# EasyEDA Pro project 校内赛最小系统板(第二版).eprj

# Schematic Schematic1

## Sheets
1 12V->5V: Board Name: Board1; Create Date: 2025-10-25; Page Name: 12V->5V; Project Name: 校内赛最小系统板; Schematic Name: Schematic1; Update Date: 2025-11-01; Company: 嘉立创EDA; Page Size: A4; Version: V1.0
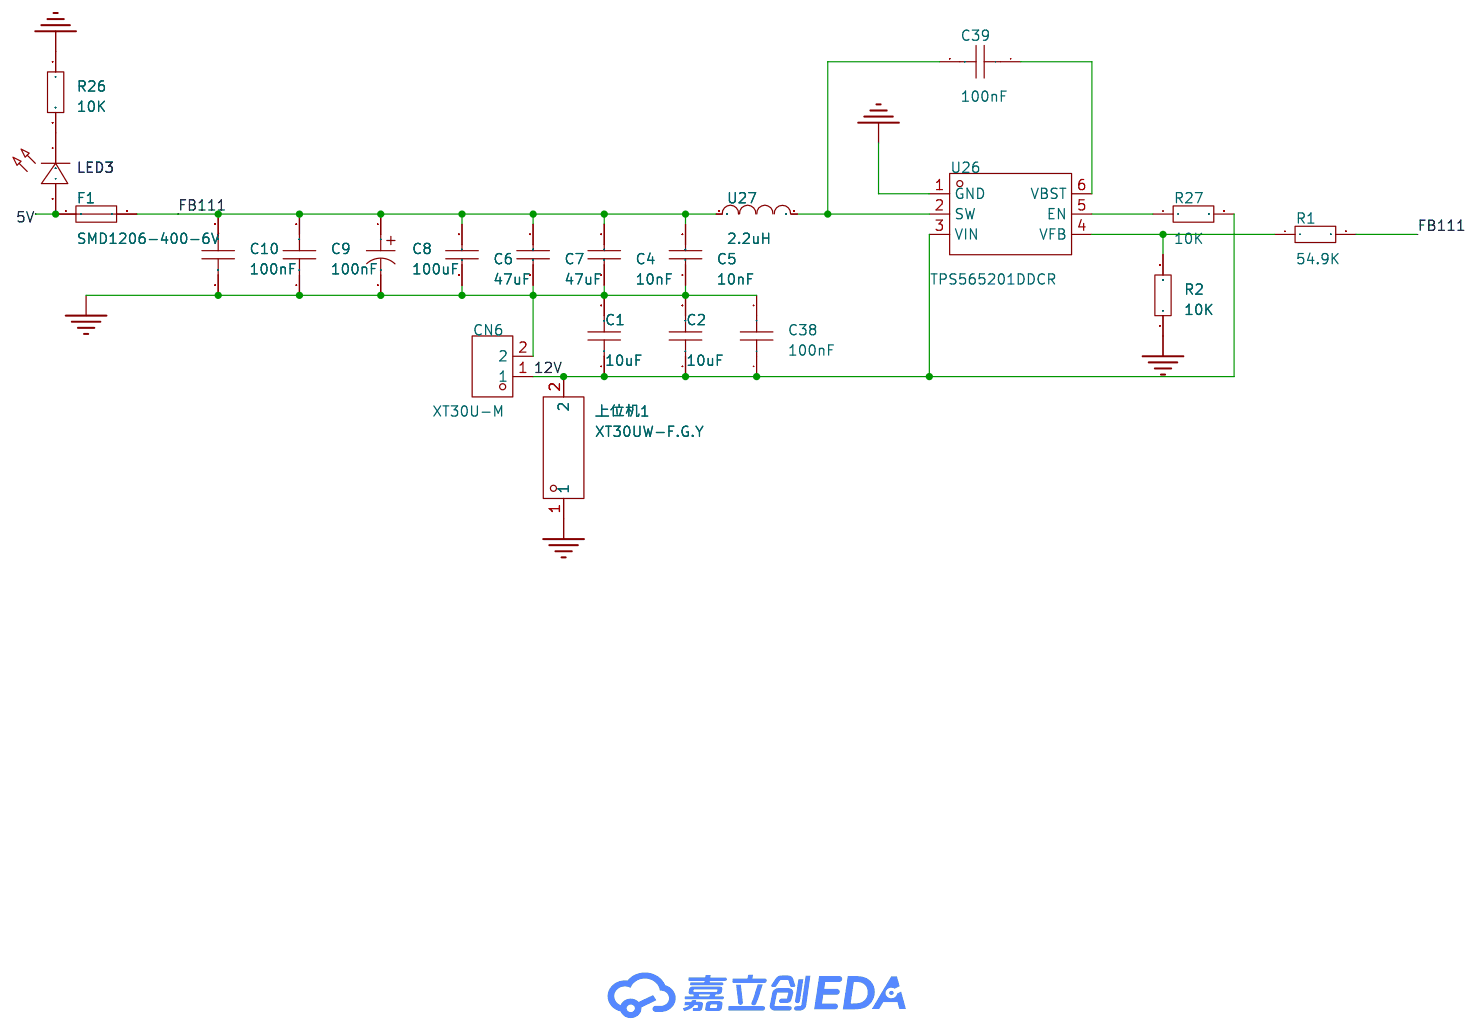
[diagram p0: 12V->5V]
2 最小系统: Page Name: 最小系统; Update Date: 2025-10-28
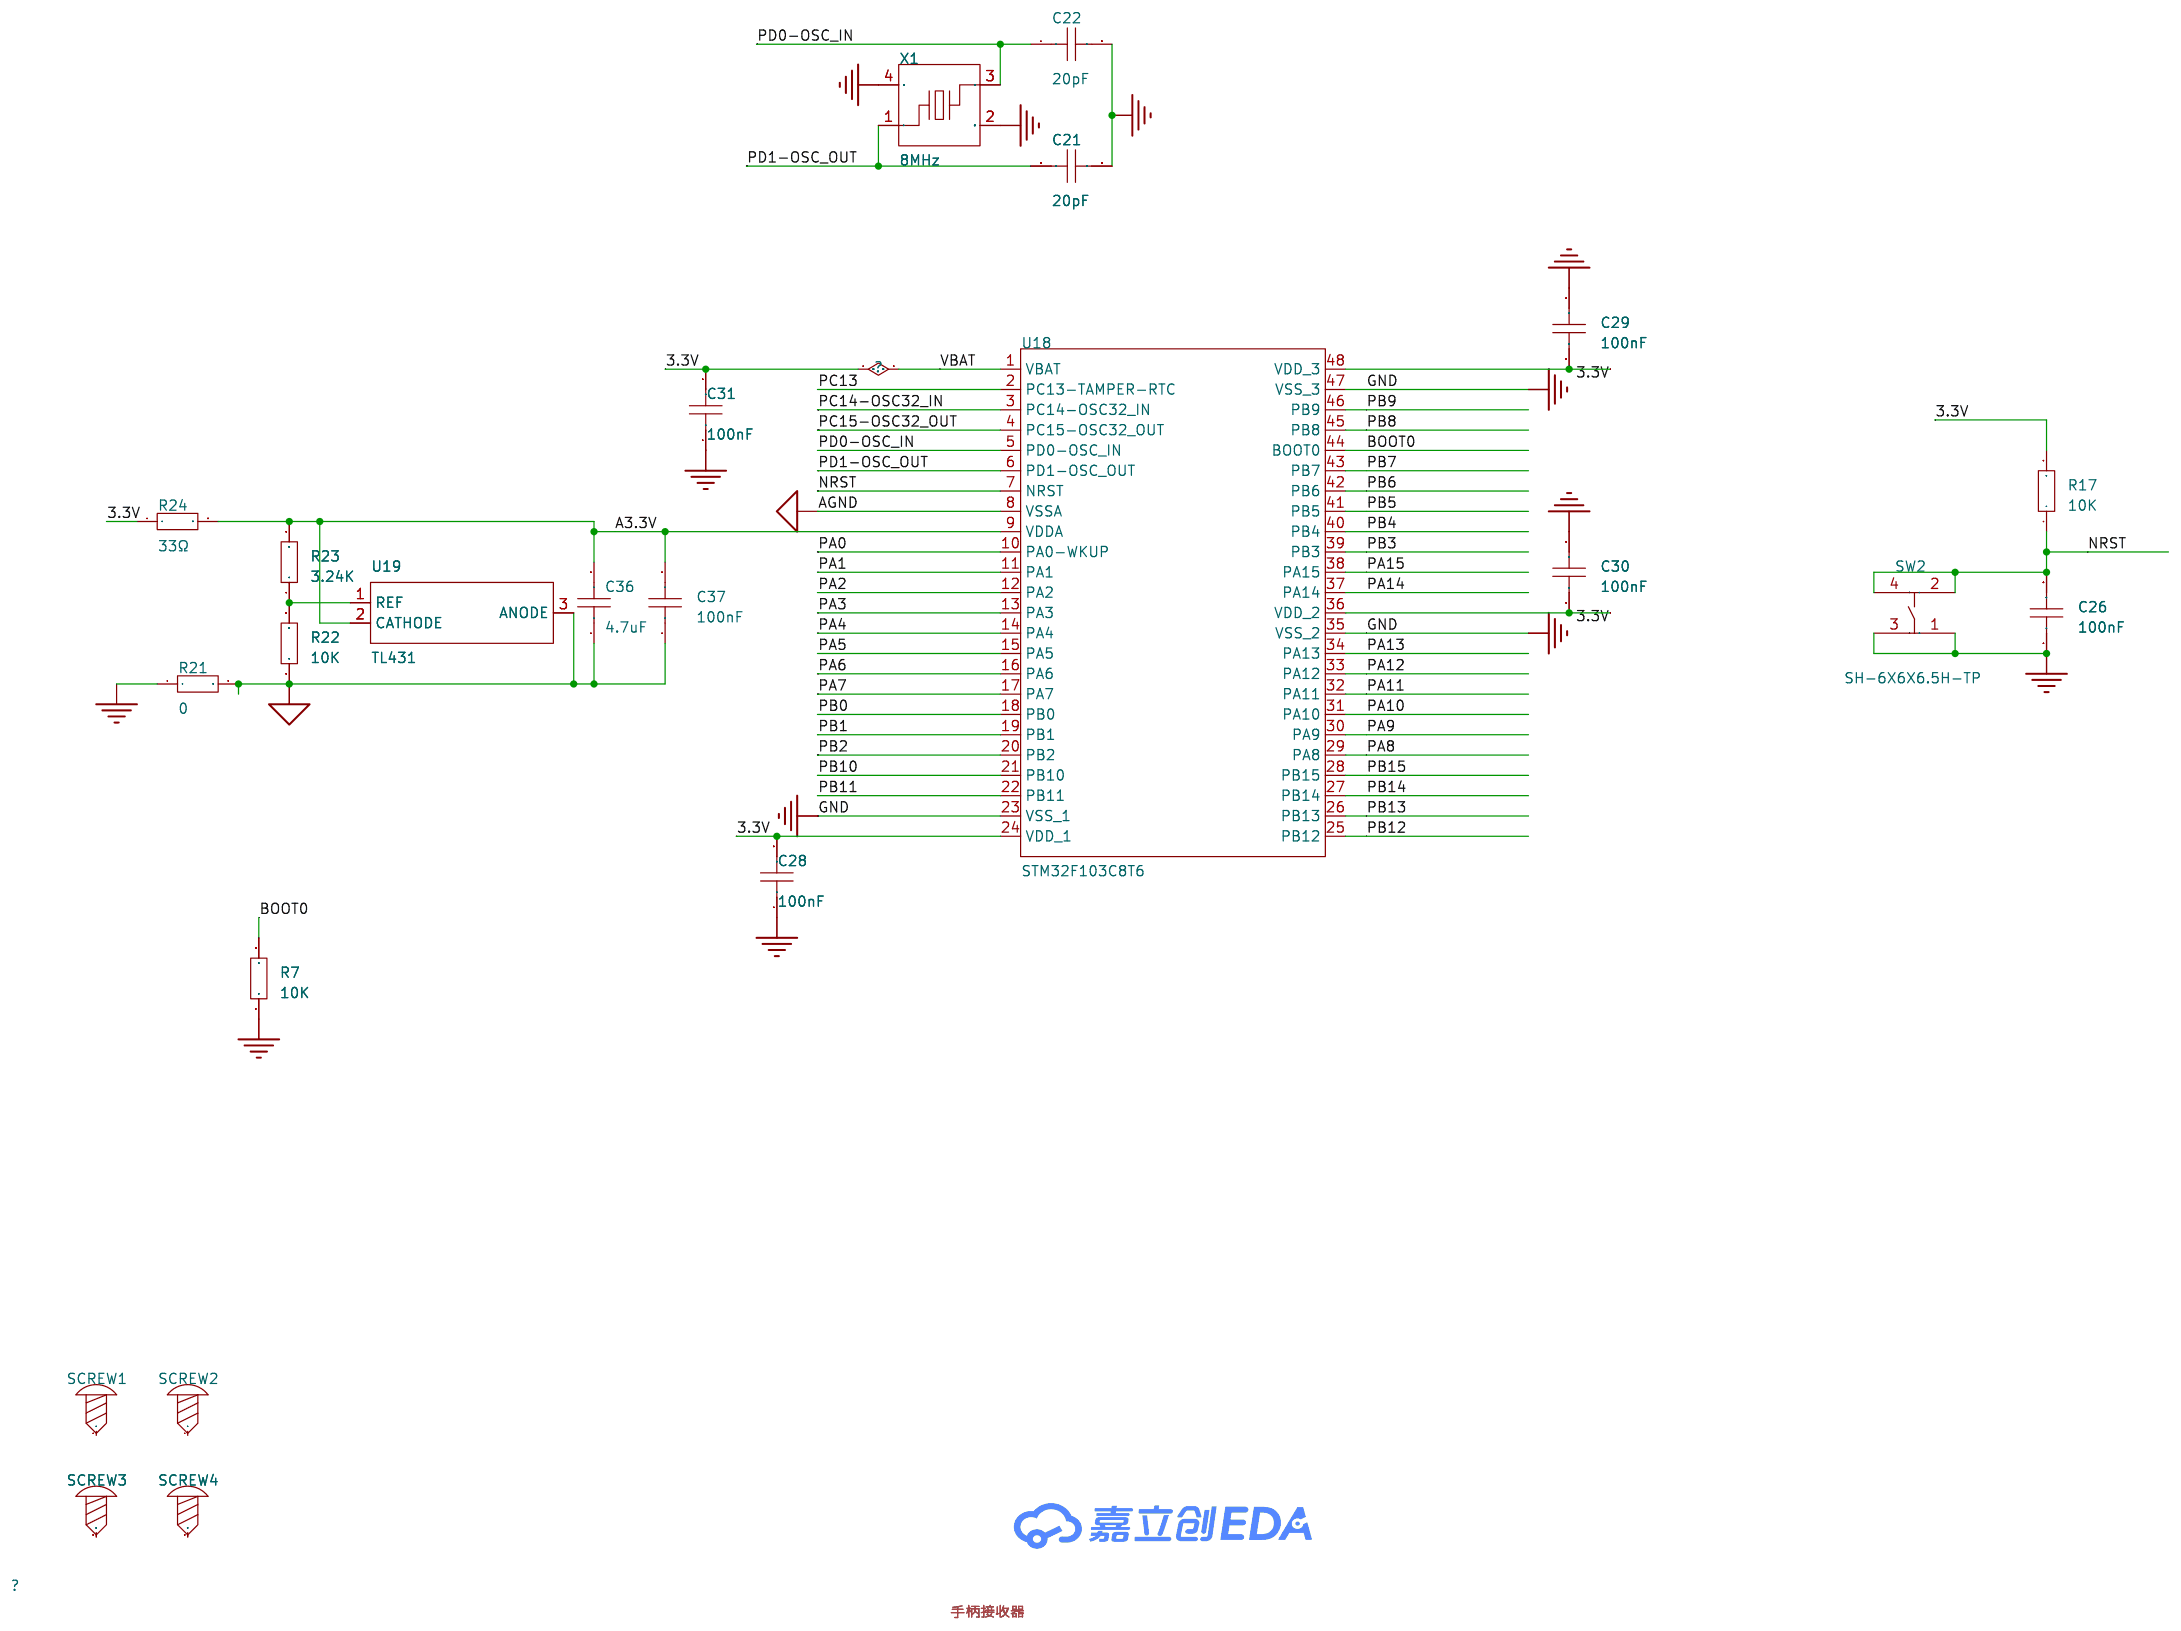
[diagram p1: 最小系统]
3 接口: Create Date: 2025-10-27; Page Name: 接口; Update Date: 2025-10-29
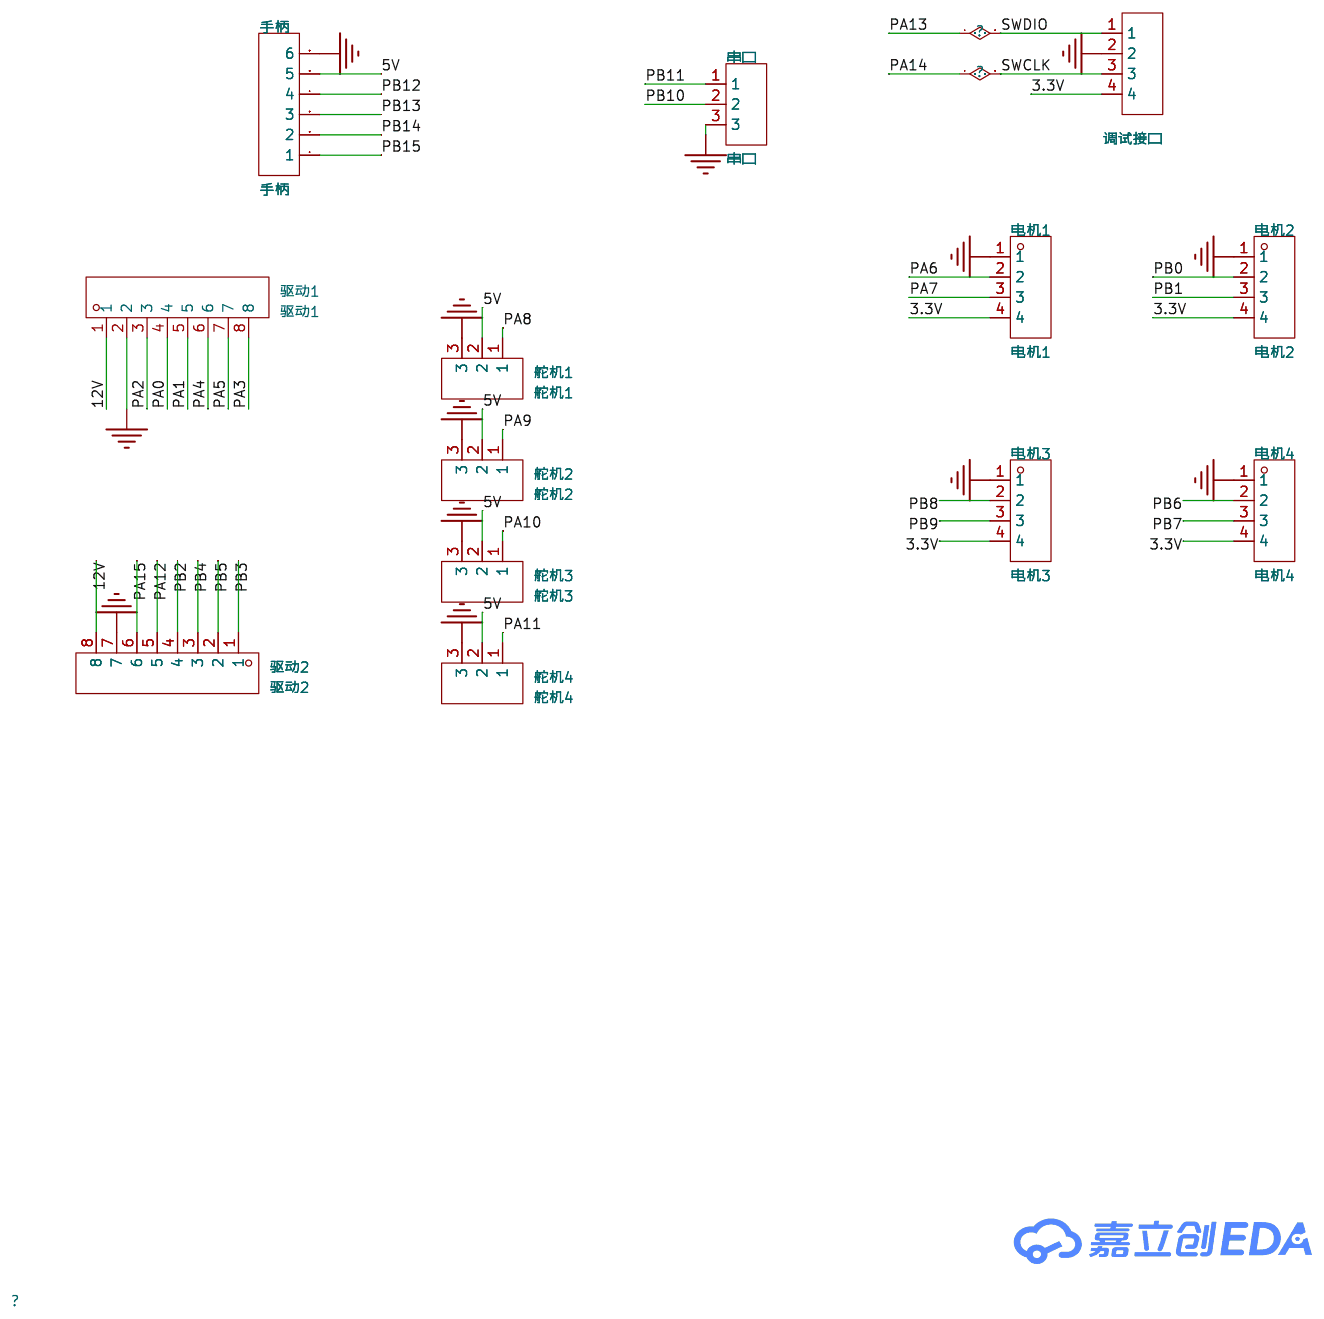
[diagram p2: 接口]
4 5V->3.3V: Create Date: 2025-10-27; Page Name: 5V->3.3V; Update Date: 2025-10-27
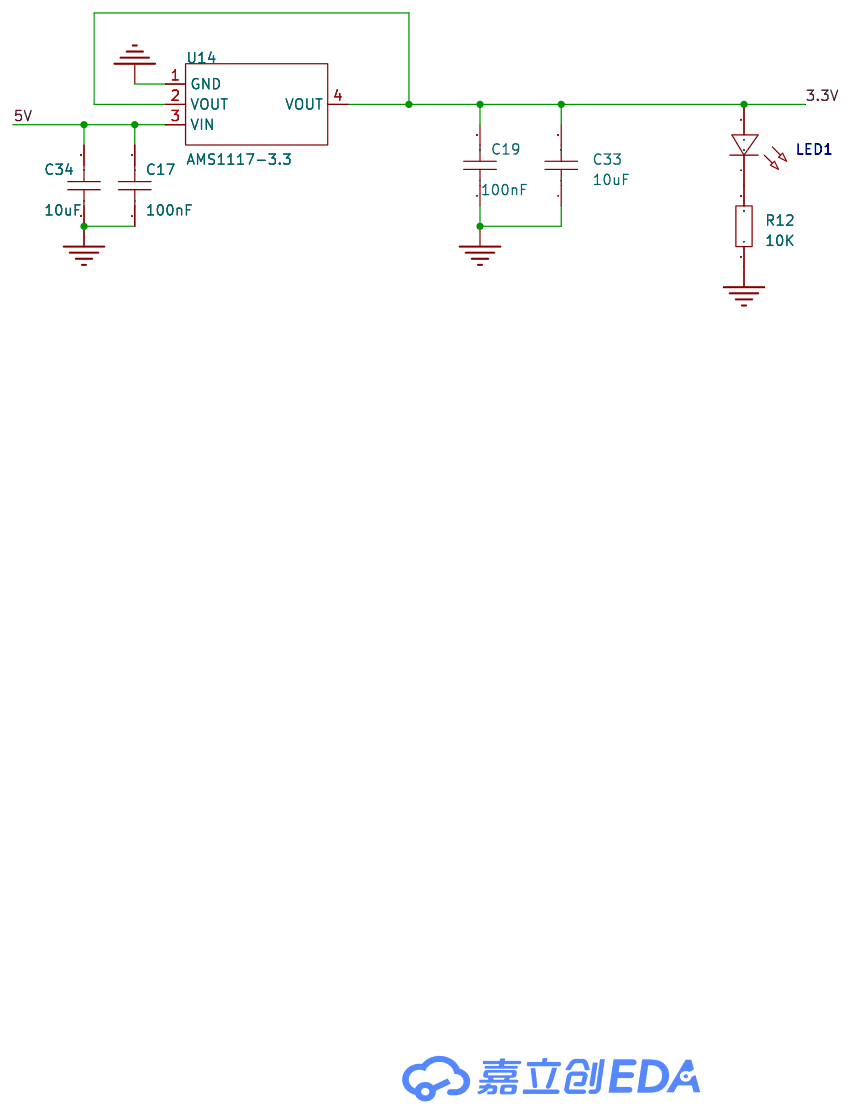
[diagram p3: 5V->3.3V]

## Parts
sheet 5V->3.3V
C17  100nF  [C0603]
C19  100nF  [C0603]
C33  10uF  [C1206]
C34  10uF  [C1206]
LED1  -  [LED_0603]
R12  10K  [R0603]
U14  AMS1117-3.3  [SOT-223-3_L6.5-W3.4-P2.30-LS7.0-BR]
sheet 12V->5V
C1  10uF  [C1206]
C2  10uF  [C1206]
C4  10nF  [C0603]
C5  10nF  [C0603]
C6  47uF  [C1210]
C7  47uF  [C1210]
C8  100uF  [CAP-SMD_BD6.3-L6.6-W6.6-LS7.2-FD_3]
C9  100nF  [C0603]
C10  100nF  [C0603]
C38  100nF  [C0603]
C39  100nF  [C0603]
CN6  XT30U-M  [CONN-TH_XT30U-M]
F1  SMD1206-400-6V  [F1206]
LED3  -  [LED_0603]
R1  54.9K  [R0603]
R2  10K  [R0603]
R26  10K  [R0603]
R27  10K  [R0603]
U26  TPS565201DDCR  [SOT-23-6_L2.9-W1.6-P0.95-LS2.8-BR]
U27  2.2uH  [IND-SMD_L7.0-W6.6]
上位机1  XT30UW-F.G.Y  [CONN-TH_XT30UW-F.G.Y]
sheet 接口
串口  串口  [HDR-TH_3P-P2.54-V-M]
手柄  手柄  [HDR-TH_6P-P2.54-V-M-1]
电机1  电机1  [HDR-TH_4P-P2.54-V-M]
电机2  电机2  [HDR-TH_4P-P2.54-V-M]
电机3  电机3  [HDR-TH_4P-P2.54-V-M]
电机4  电机4  [HDR-TH_4P-P2.54-V-M]
舵机1  舵机1  [HDR-TH_3P-P2.54-V-M]
舵机2  舵机2  [HDR-TH_3P-P2.54-V-M]
舵机3  舵机3  [HDR-TH_3P-P2.54-V-M]
舵机4  舵机4  [HDR-TH_3P-P2.54-V-M]
调试接口  -  [HDR-TH_4P-P2.54-V-M]
驱动1  驱动1  [HDR-TH_8P-P2.54-V-M-4]
驱动2  驱动2  [HDR-TH_8P-P2.54-V-M-4]
sheet 最小系统
C21  20pF  [C0603]
C22  20pF  [C0603]
C26  100nF  [C0603]
C28  100nF  [C0603]
C29  100nF  [C0603]
C30  100nF  [C0603]
C31  100nF  [C0603]
C36  4.7uF  [C0603]
C37  100nF  [C0603]
R7  10K  [R1206]
R17  10K  [R1206]
R21  0  [R0603]
R22  10K  [R1206]
R23  3.24K  [R1206]
R24  33Ω  [R1206]
SCREW1  -  [M2螺丝]
SCREW2  -  [M2螺丝]
SCREW3  -  [M2螺丝]
SCREW4  -  [M2螺丝]
SW2  SH-6X6X6.5H-TP  [SW-SMD_4P-L6.0-W6.0-P4.50-LS8.8]
U18  STM32F103C8T6  [LQFP-48_L7.0-W7.0-P0.50-LS9.0-BL]
U19  TL431  [SOT-23-3_L2.9-W1.3-P1.90-LS2.4-BR]
X1  8MHz  [CRYSTAL-SMD_4P-L3.2-W2.5-BL_SIT8008BI]

## Library data of the parts
C17 C19 C21 C22 C26 C28-C31 C36 C37 = CAP_0603: Supplier Footprint: 0603
C1 C2 C33 C34 = CAP_1206: Supplier Footprint: 1206
LED1 LED3 = LED_0603-G: Supplier Footprint: 0603
R1 R2 R12 R21 R26 R27 = Res_0603: Supplier Footprint: 0603
U14 = AMS1117-3.3_C6186: 输出类型:固定;工作电压:16V;输出电压:3.3V;输出电流:1A;电源纹波抑制比(PSRR):72dB@(120Hz);输出极性:正极;; LCSC Part Name: 输出3.3V 1A; Supplier Part: C6186; Manufacturer: AMS; Supplier Footprint: SOT-223; JLCPCB Part Class: 基础库; Datasheet: https://item.szlcsc.com/datasheet/AMS1117-3.3/6652.html; Supplier: LCSC; Output Type: 固定; Voltage - Supply: 16V; Output Voltage: 3.3V; Output Current: 1A; Power Supply Rejection Ratio (PSRR): 72dB@(120Hz); Voltage Dropout: 1.1V@(800mA); standby current: 5mA; Features: 过流保护；过热保护; Operating Temperature: -40℃~+125℃; Output Configuration: 正极; Number of Outputs: 1
C4 C5 = 0603B103K500NT: LCSC Part Name: 10nF ±10% 50V; Supplier Part: C57112; Manufacturer: FH(风华); Supplier Footprint: 0603; JLCPCB Part Class: 基础库; Datasheet: https://item.szlcsc.com/datasheet/0603B103K500NT/58143.html; Supplier: LCSC; Tolerance: ±10%; Voltage Rating: 50V; Temperature Coefficient: X7R
C6 C7 = GRM32ER71A476KE15L: LCSC Part Name: 47uF ±10% 10V; Supplier Part: C84494; Manufacturer: muRata(村田); Supplier Footprint: 1210; JLCPCB Part Class: 扩展库; Datasheet: https://atta.szlcsc.com/upload/public/pdf/source/20161226/1482720144456.pdf; Supplier: LCSC; Tolerance: ±10%; Voltage Rated: 10V; Temperature Coefficient: X7R
C8 = JVJ16V100M6x5: LCSC Part Name: 100uF ±20% 16V; Supplier Part: C46550396; Manufacturer: JIERR(捷而瑞); Supplier Footprint: SMD,D6.3xL5.4mm; JLCPCB Part Class: 扩展库; Datasheet: https://item.szlcsc.com/datasheet/JVJ16V100M6x5/48680090.html; Supplier: LCSC; Tolerance: ±20%; Voltage Rating: 16V; Ripple Current: 60mA@120Hz; Diameter: 6.3mm; Height - Seated (Max): 5.4mm; Lifetime: 2000hrs@105℃; Operating Temperature: -55℃~+105℃
C9 C10 C38 C39 = CC0603KRX7R9BB104: LCSC Part Name: 100nF ±10% 50V; Supplier Part: C14663; Manufacturer: YAGEO(国巨); Supplier Footprint: 0603; JLCPCB Part Class: 基础库; Datasheet: https://item.szlcsc.com/datasheet/CC0603KRX7R9BB104/15331.html; Supplier: LCSC; Tolerance: ±10%; Voltage Rating: 50V; Temperature Coefficient: X7R
CN6 = XT30U-M: LCSC Part Name: AMASS(艾迈斯)轻量版锂电池插头公头 XT30U-M; Supplier Part: C99101; Manufacturer: AMASS(艾迈斯); JLCPCB Part Class: 扩展库; Datasheet: https://item.szlcsc.com/datasheet/XT30U-M/100314.html; Supplier: LCSC; Type: 插头; Colour: 黄色; InterfaceType: 公头
F1 = SMD1206-400-6V: LCSC Part Name: 6V 4A 1206自恢复; Supplier Part: C2760306; Manufacturer: BNstar(比诺星); Supplier Footprint: 1206; JLCPCB Part Class: 扩展库; Datasheet: https://item.szlcsc.com/datasheet/SMD1206-400-6V/2880918.html; Supplier: LCSC; Voltage - Max: 6V; Current - Max: 50A; Hold Current: 4A; Trip Current: 8A; Power Dissipation: 1.5W; Resistance - Initial (Ri) (Min): 1mΩ; Resistance - Post Trip (R1) (Max): 18mΩ; Time to Trip(Max): 5s; Operating Temperature: -40℃~+70℃; Length: 3.5mm; Width: 1.85mm; Height: 1mm
U26 = TPS565201DDCR: LCSC Part Name: 4.5V至17V输入、5A同步降压稳压器; Supplier Part: C327676; Manufacturer: TI(德州仪器); Supplier Footprint: TSOT-23-6; JLCPCB Part Class: 扩展库; Datasheet: https://www.ti.com.cn/cn/lit/ds/symlink/tps565201.pdf; Supplier: LCSC; Function: 降压型; Output Type: 可调; Input Voltage: 4.5V~17V; Output Voltage: 760mV~7V; Output Current: 5A; Switching Frequency: 500kHz; Operating Temperature: -40℃~+125℃; Synchronous Rectification: 是; Number of Outputs: 1; Topology: 降压式; Switch tube (built-in/external): 内置
U27 = FAUL0650-2R2MT: LCSC Part Name: 2.2uH ±20% 11A; Supplier Part: C3040365; Manufacturer: cjiang(长江微电); Supplier Footprint: SMD,7x6.6mm; JLCPCB Part Class: 扩展库; Datasheet: https://item.szlcsc.com/datasheet/FAUL0650-2R2MT/3597542.html; Supplier: LCSC; Tolerance: ±20%; Current Rating: 9A; Current - Saturation(Isat): 11A; DC Resistance(DCR): 12.5mΩ; Ratings: AEC-Q200
上位机1 = XT30UW-F.G.Y: LCSC Part Name: XT30UW防水锁扣镀金15A二芯母插头; Supplier Part: C19268025; Manufacturer: AMASS(艾迈斯); JLCPCB Part Class: 扩展库; Datasheet: https://item.szlcsc.com/datasheet/XT30UW-F.G.Y/20526036.html; Supplier: LCSC
串口 舵机1-舵机4 = PZ254V-11-03P: LCSC Part Name: 1x3P 间距:2.54mm 方针 直插; Supplier Part: C2937625; Manufacturer: XFCN(兴飞); Supplier Footprint: 插件,P=2.54mm; JLCPCB Part Class: 扩展库; Datasheet: https://item.szlcsc.com/datasheet/PZ254V-11-03P/3293280.html; Supplier: LCSC; Pin Structure: 1x3P; Pitch: 2.54mm; Circluar Pins/Square Pins: 方针; Mounting Type: 直插; Number of Rows: 单排; Number of Pins: 3P; Current Rating: 3A; Voltage Rating (Max): 250V; Length of Mating Pin: 6mm; Insulation Height: 2.5mm; Length of End Connection Pin: 3mm; Operating Temperature: -40℃~+105℃; Color: 黑色
手柄 = 2.54-1x6P直针: LCSC Part Name: 1x6P 间距:2.54mm 方针 直插; Supplier Part: C37208; Manufacturer: BOOMELE(博穆精密); Supplier Footprint: 插件,P=2.54mm; JLCPCB Part Class: 扩展库; Datasheet: https://item.szlcsc.com/datasheet/2.54-1x6P%25E7%259B%25B4%25E9%2592%2588/38187.html; Supplier: LCSC; Pin Structure: 1x6P; Pitch: 2.54mm; Circluar Pins/Square Pins: 方针; Mounting Type: 直插; Number of Rows: 单排; Number of Pins: 6P; Current Rating: 3A; Length of Mating Pin: 6mm; Insulation Height: 2.5mm; Length of End Connection Pin: 3mm; Contact Material: 黄铜; Contact Plating: 金; Operating Temperature: -40℃~+105℃; Color: 黑色
电机1-电机4 = PZ254V-11-04P: LCSC Part Name: 1x4P 间距:2.54mm 方针 直插; Supplier Part: C2691448; Manufacturer: XFCN(兴飞); Supplier Footprint: 插件,P=2.54mm; JLCPCB Part Class: 扩展库; Datasheet: https://item.szlcsc.com/datasheet/PZ254V-11-04P/2801085.html; Supplier: LCSC; Pin Structure: 1x4P; Pitch: 2.54mm; Circluar Pins/Square Pins: 方针; Mounting Type: 直插; Number of Rows: 单排; Number of Pins: 4P; Current Rating: 3A; Voltage Rating (Max): 250V; Length of Mating Pin: 6mm; Insulation Height: 2.5mm; Length of End Connection Pin: 3mm; Operating Temperature: -40℃~+105℃; Color: 黑色
调试接口 = HDR-M_2.54_1x4P: Supplier Part: C492403; Supplier Footprint: 插件; JLCPCB Part Class: 扩展库
驱动1 驱动2 = 2.54mmx8: Supplier Part: C9900030426; Supplier Footprint: 2.54*8P/30mm; JLCPCB Part Class: 扩展库; Supplier: LCSC
R7 R17 R22-R24 = Res_1206: Supplier Footprint: 1206
SCREW1-SCREW4 = M2螺丝: Supplier Footprint: 插件
SW2 = SH-6X6X6.5H-TP: 电路结构:单刀单掷;按钮形状:圆形按钮;作用力:2.5N;安装方式:立贴;开关长度:6mm;开关宽度:6mm;开关高度:6.5mm;带支架:不带支架;触点电流:50mA;额定电压:12V;带灯:无;工作寿命:10万次;; LCSC Part Name: 6*6/6x6 轻触开关; Supplier Part: C42416255; Manufacturer: SHOU HAN(首韩); Supplier Footprint: SMD-4P,6x6mm; JLCPCB Part Class: 扩展库; Datasheet: https://item.szlcsc.com/datasheet/SH-6X6X6.5H-TP/44415302.html; Supplier: LCSC; Circuit: 单刀单掷; Actuator Style: 圆形按钮; Operating Force: 2.5N; Mounting Type: 立贴; Length: 6mm; Width: 6mm; Switch Height: 6.5mm; with Bracket: 不带支架; Contact Current: 50mA; Voltage Rating: 12V; Actuator/Cap Color: 黑色; With Lamp: 无; Termination Style: 鸥翼型; Life: 10万次; Operating Temperature: -25℃~+70℃
U18 = STM32F103C8T6: CPU内核:ARM-M3;CPU最大主频:72MHz;应用领域:-;; LCSC Part Name: 主流增强型ARM Cortex-M3 MCU，具有64 KB Flash、72 MHz CPU、电机控制、USB和CAN; Supplier Part: C8734; Manufacturer: ST(意法半导体); Supplier Footprint: LQFP-48(7x7); JLCPCB Part Class: 扩展库; Datasheet: https://item.szlcsc.com/datasheet/STM32F103C8T6/9243.html; Supplier: LCSC; CPU Core: ARM-M3; CPU Maximum Speed: 72MHz; Program Storage Size: 64KB; Program Memory Type: FLASH; Number of I/O: 37; ADC (Bit): 12bit; Voltage - Supply: 2V~3.6V
U19 = TL431: Supplier Part: C2887585; Manufacturer: YFSEMI(江苏佑风微); Supplier Footprint: SOT-23; JLCPCB Part Class: 扩展库; Datasheet: https://item.szlcsc.com/datasheet/TL431/3105114.html; Supplier: LCSC
X1 = XL2EL89CSI-111YLC-8M: 晶振类型:贴片晶振;频率:8MHz;常温频差:±10ppm;负载电容:20pF;频率稳定度:±20ppm;; LCSC Part Name: YSX321SL 8MHZ 4P 3225 20PF ±10PPM -40~85℃ (±20PPM); Supplier Part: C5444548; Manufacturer: YXC(扬兴晶振); Supplier Footprint: SMD3225-4P; JLCPCB Part Class: 扩展库; Datasheet: https://item.szlcsc.com/datasheet/XL2EL89CSI-111YLC-8M/6336544.html; Supplier: LCSC; Type: 贴片晶振; Normal temperature Frequency Tolerance: ±10ppm; Load Capacitance: 20pF; Frequency Stability: ±20ppm; Operating Temperature: -40℃~+85℃

## Nets
3.3V: C19.2 C28.2 C29.2 C30.2 C31.2 C33.2 LED1.2(A) R17.2 R24.1 U14.2(VOUT) U14.4(VOUT) U18.1(VBAT) U18.24(VDD_1) U18.36(VDD_2) U18.48(VDD_3) 电机1.4 电机2.4 电机3.4 电机4.4 调试接口.4
5V: C17.2 C34.2 F1.1 LED3.2(A) U14.3(VIN) 手柄.5 舵机1.2 舵机2.2 舵机3.2 舵机4.2
12V: C1.1 C2.1 C38.1 CN6.1 R27.2 U26.3(VIN) 上位机1.2 驱动1.1 驱动2.8
A3.3V: C36.2 C37.2 R23.2 R24.2 U18.9(VDDA) U19.2(CATHODE)
AGND: C36.1 C37.1 R21.2 R22.1 U18.8(VSSA) U19.3(ANODE)
GND: C1.2 C2.2 C4.1 C5.1 C6.1 C7.1 C8.2 C9.1 C10.1 C17.1 C19.1 C21.2 C22.2 C26.1 C28.1 C29.1 C30.1 C31.1 C33.1 C34.1 C38.2 CN6.2 R2.1 R7.1 R12.1 R21.1 R26.1 SW2.1 SW2.3 U14.1(GND) U18.23(VSS_1) U18.35(VSS_2) U18.47(VSS_3) U26.1(GND) X1.2(GND) X1.4(GND) 上位机1.1 串口.3 手柄.6 电机1.1 电机2.1 电机3.1 电机4.1 舵机1.3 舵机2.3 舵机3.3 舵机4.3 调试接口.2 驱动1.2 驱动2.7
BOOT0: R7.2 U18.44(BOOT0)
FB111: C4.2 C5.2 C6.2 C7.2 C8.1 C9.2 C10.2 F1.2 R1.2 U27.1
NRST: C26.2 R17.1 SW2.2 SW2.4 U18.7(NRST)
PA0: U18.10(PA0-WKUP) 驱动1.4
PA1: U18.11(PA1) 驱动1.5
PA2: U18.12(PA2) 驱动1.3
PA3: U18.13(PA3) 驱动1.8
PA4: U18.14(PA4) 驱动1.6
PA5: U18.15(PA5) 驱动1.7
PA6: U18.16(PA6) 电机1.2
PA7: U18.17(PA7) 电机1.3
PA8: U18.29(PA8) 舵机1.1
PA9: U18.30(PA9) 舵机2.1
PA10: U18.31(PA10) 舵机3.1
PA11: U18.32(PA11) 舵机4.1
PA12: U18.33(PA12) 驱动2.5
PA13: U18.34(PA13) 调试接口.1
PA14: U18.37(PA14) 调试接口.3
PA15: U18.38(PA15) 驱动2.6
PB0: U18.18(PB0) 电机2.2
PB1: U18.19(PB1) 电机2.3
PB2: U18.20(PB2) 驱动2.4
PB3: U18.39(PB3) 驱动2.1
PB4: U18.40(PB4) 驱动2.3
PB5: U18.41(PB5) 驱动2.2
PB6: U18.42(PB6) 电机4.2
PB7: U18.43(PB7) 电机4.3
PB8: U18.45(PB8) 电机3.2
PB9: U18.46(PB9) 电机3.3
PB10: U18.21(PB10) 串口.2
PB11: U18.22(PB11) 串口.1
PB12: U18.25(PB12) 手柄.4
PB13: U18.26(PB13) 手柄.3
PB14: U18.27(PB14) 手柄.2
PB15: U18.28(PB15) 手柄.1
PC13: U18.2(PC13-TAMPER-RTC)
PC14-OSC32_IN: U18.3(PC14-OSC32_IN)
PC15-OSC32_OUT: U18.4(PC15-OSC32_OUT)
PD0-OSC_IN: C22.1 U18.5(PD0-OSC_IN) X1.3
PD1-OSC_OUT: C21.1 U18.6(PD1-OSC_OUT) X1.1
$1N6828: C39.2 U26.2(SW) U27.2
$1N7531: LED3.1(C) R26.2
$1N7618: C39.1 U26.6(VBST)
$1N7672: R27.1 U26.5(EN)
$1N7875: R1.1 R2.2 U26.4(VFB)
$2N2524: R22.2 R23.1 U19.1(REF)
$4N488: LED1.1(C) R12.2

Not connected (* = marked no-connect by the designer): SCREW1 1; SCREW2 1; SCREW3 1; SCREW4 1

# Board PCB1
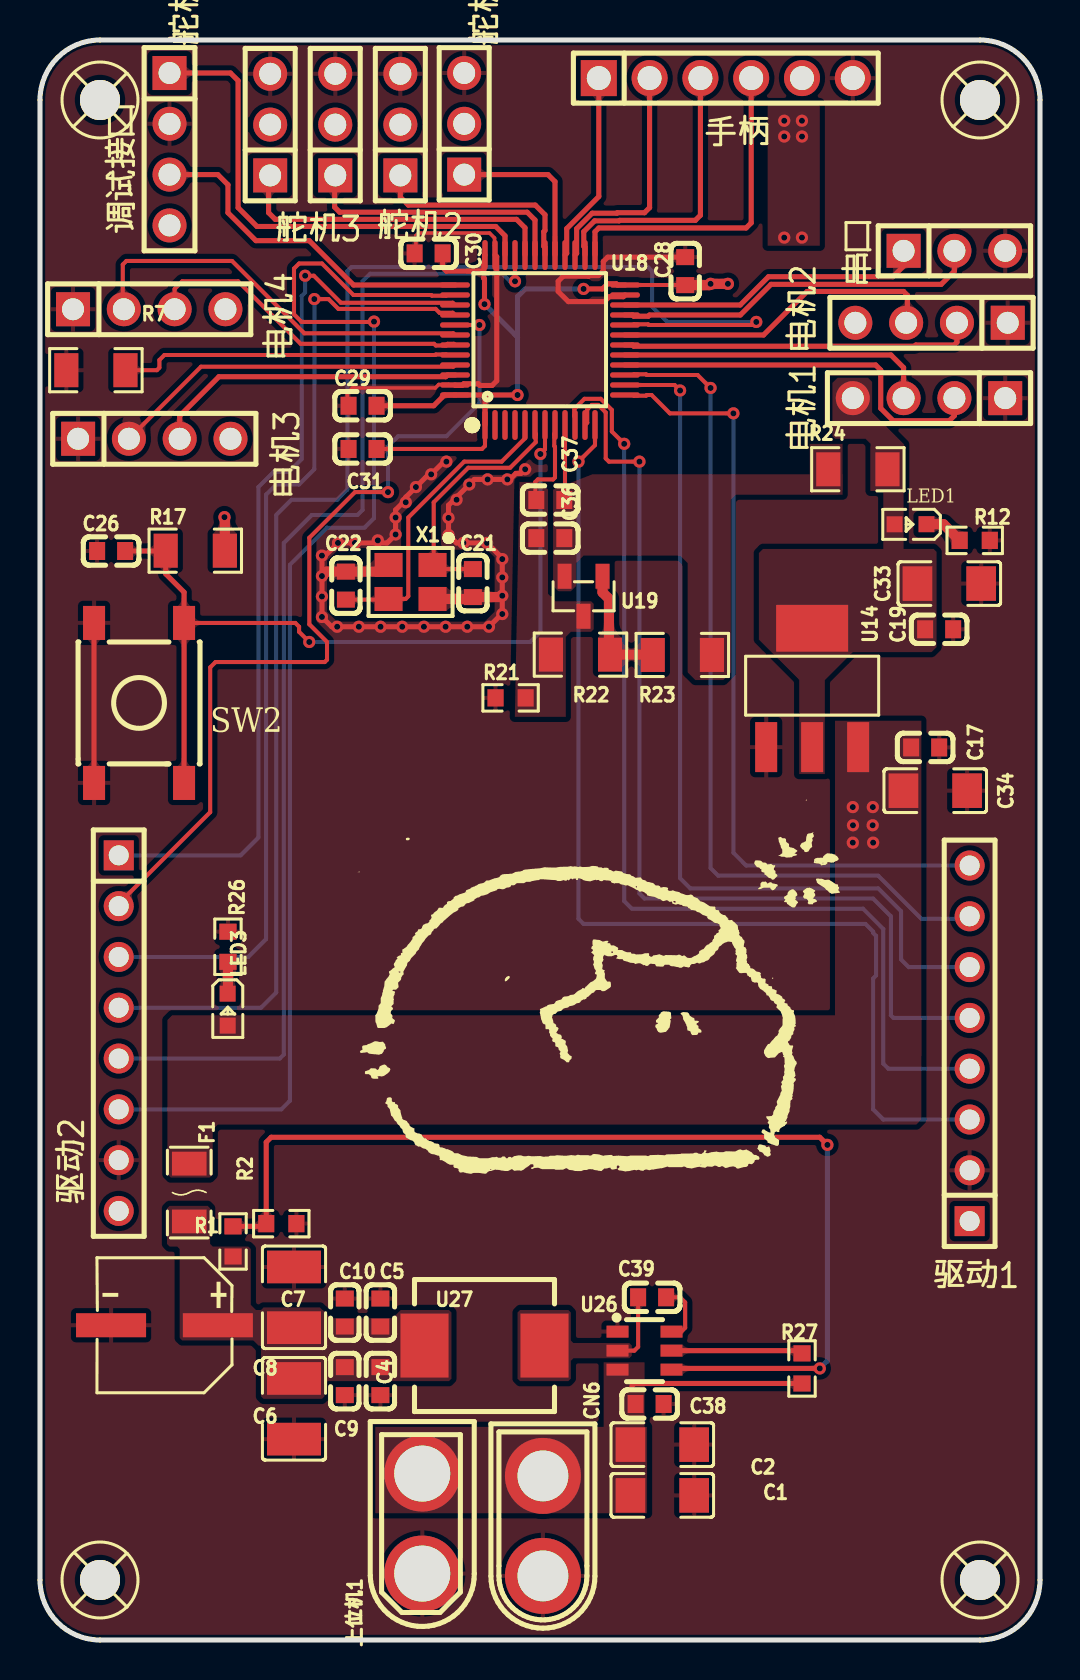
[diagram p4: board, top side]
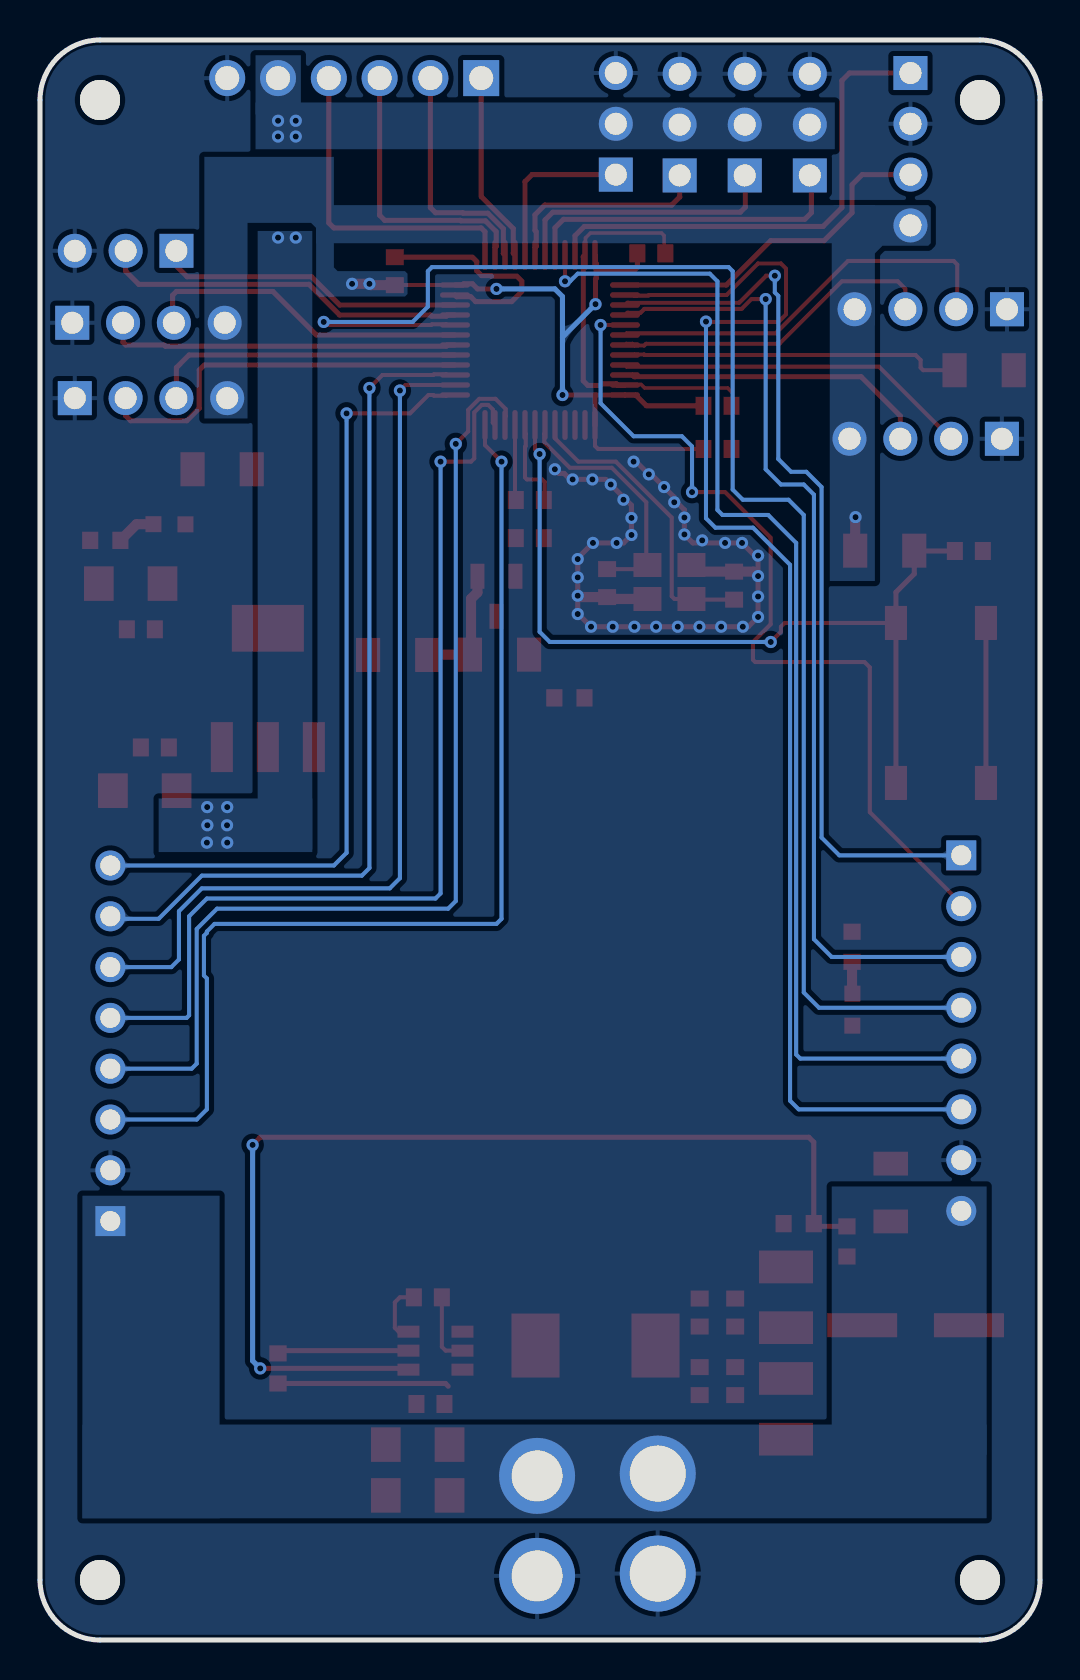
[diagram p5: board, bottom side, seen from below]

Outline 50 x 80 mm; copper layers: Top Layer, Bottom Layer. Coordinates in mm from the lower left corner of the outline.
Outline path: 0,77 0,3 arc(0.88,0.88) 3,0 47,0 arc(49.12,0.88) 50,3 50,77 arc(49.12,79.12) 47,80 3,80 arc(0.88,79.12) 0,77
Stack: Top Layer 0.035mm / Dielectric1 1.51mm FR4 er 4.5 / Bottom Layer 0.035mm

## Design rules (mm)
template: JLCPCB Capability(Two Layers Board)
spacing copperThickness1oz (default): track to track 0.102, other pairs 0.152 to 0.3
spacing copperThickness2oz: track to track 0.203, other pairs 0.152 to 0.3
track width copperThickness1oz (default): min 0.127, default 0.254, max 2.54
track width copperThickness2oz: min 0.203, default 0.254, max 2.54
differential pair differentialPair (default): width min 0.127, default 0.254, max 2.54; gap min 0.152, default 0.152
via viaSize (default): diameter min 0.5, default 0.61, max 10; hole min 0.3, default 0.305, max 6.3

## Placement (name value [footprint] x y rotation side)
C1  10uF  [C1206]  31.12 9.77 0 top
C2  10uF  [C1206]  31.12 7.23 0 top
C4  10nF  [C0603]  17.02 12.94 90 top
C5  10nF  [C0603]  17.02 16.37 270 top
C6  47uF  [C1210]  12.7 11.56 90 top
C7  47uF  [C1210]  12.7 17.13 270 top
C8  100uF  [CAP-SMD_BD6.3-L6.6-W6.6-LS7.2-FD_3]  6.22 15.74 180 top
C9  100nF  [C0603]  15.24 12.94 90 top
C10  100nF  [C0603]  15.24 16.37 270 top
C17  100nF  [C0603]  44.26 44.63 180 top
C19  100nF  [C0603]  44.96 50.54 180 top
C21  20pF  [C0603]  21.65 52.85 270 top
C22  20pF  [C0603]  15.3 52.72 90 top
C26  100nF  [C0603]  3.56 54.45 0 top
C28  100nF  [C0603]  32.26 68.44 270 top
C29  100nF  [C0603]  16.13 61.71 0 top
C30  100nF  [C0603]  19.43 69.33 0 top
C31  100nF  [C0603]  16.13 59.55 0 top
C33  10uF  [C1206]  45.47 52.82 180 top
C34  10uF  [C1206]  44.76 42.47 180 top
C36  4.7uF  [C0603]  25.51 55.09 0 top
C37  100nF  [C0603]  25.51 57 0 top
C38  100nF  [C0603]  30.48 11.8 0 top
C39  100nF  [C0603]  30.61 17.13 180 top
CN6  XT30U-M  [CONN-TH_XT30U-M]  25.15 5.71 270 top
F1  SMD1206-400-6V  [F1206]  7.46 22.37 270 top
LED1  -  [LED_0603]  43.48 55.78 180 top
LED3  -  [LED_0603]  9.39 31.47 270 top
R1  54.9K  [R0603]  9.65 19.93 270 top
R2  10K  [R0603]  12.06 20.82 180 top
R7  10K  [R1206]  2.79 63.49 0 top
R12  10K  [R0603]  46.74 54.98 180 top
R17  10K  [R1206]  7.76 54.47 0 top
R21  0  [R0603]  23.53 47.11 0 top
R22  10K  [R1206]  27.02 49.27 0 top
R23  3.24K  [R1206]  32.12 49.25 0 top
R24  33Ω  [R1206]  40.89 58.54 180 top
R26  10K  [R0603]  9.4 34.66 270 top
R27  10K  [R0603]  38.1 13.58 270 top
SCREW1  -  [M2螺丝]  47 77 0 top
SCREW2  -  [M2螺丝]  3 77 0 top
SCREW3  -  [M2螺丝]  47 3 0 top
SCREW4  -  [M2螺丝]  3 3 0 top
SW2  SH-6X6X6.5H-TP  [SW-SMD_4P-L6.0-W6.0-P4.50-LS8.8]  4.95 46.85 90 top
U14  AMS1117-3.3  [SOT-223-3_L6.5-W3.4-P2.30-LS7.0-BR]  38.61 47.61 270 top
U18  STM32F103C8T6  [LQFP-48_L7.0-W7.0-P0.50-LS9.0-BL]  25 65 0 top
U19  TL431  [SOT-23-3_L2.9-W1.3-P1.90-LS2.4-BR]  27.18 52.19 90 top
U26  TPS565201DDCR  [SOT-23-6_L2.9-W1.6-P0.95-LS2.8-BR]  30.23 14.47 180 top
U27  2.2uH  [IND-SMD_L7.0-W6.6]  22.22 14.72 0 top
X1  8MHz  [CRYSTAL-SMD_4P-L3.2-W2.5-BL_SIT8008BI]  18.53 52.9 180 top
上位机1  XT30UW-F.G.Y  [CONN-TH_XT30UW-F.G.Y]  19.11 5.82 90 top
串口  串口  [HDR-TH_3P-P2.54-V-M]  45.72 69.46 0 top
手柄  手柄  [HDR-TH_6P-P2.54-V-M-1]  34.29 78.09 0 top
电机1  电机1  [HDR-TH_4P-P2.54-V-M]  44.45 62.09 180 top
电机2  电机2  [HDR-TH_4P-P2.54-V-M]  44.58 65.86 180 top
电机3  电机3  [HDR-TH_4P-P2.54-V-M]  5.72 60.06 0 top
电机4  电机4  [HDR-TH_4P-P2.54-V-M]  5.46 66.54 0 top
舵机1  舵机1  [HDR-TH_3P-P2.54-V-M]  21.21 75.81 90 top
舵机2  舵机2  [HDR-TH_3P-P2.54-V-M]  18.02 75.77 90 top
舵机3  舵机3  [HDR-TH_3P-P2.54-V-M]  14.76 75.77 90 top
舵机4  舵机4  [HDR-TH_3P-P2.54-V-M]  11.51 75.77 90 top
调试接口  -  [HDR-TH_4P-P2.54-V-M]  6.48 74.54 270 top
驱动1  驱动1  [HDR-TH_8P-P2.54-V-M-4]  46.48 29.83 90 top
驱动2  驱动2  [HDR-TH_8P-P2.54-V-M-4]  3.94 30.34 270 top

## Footprints (pads in the part's own frame, mm; a bottom-side part is the same pattern mirrored in y, then rotated)
C0603
  rect 0.8x0.9 smd: 1(-0.7,0) 2(0.7,0)
C1206
  rect 1.485x1.728 smd: 1(-1.593,0) 2(1.593,0)
C1210
  rect 1.635x2.7 smd: 1(-1.518,0) 2(1.518,0)
CAP-SMD_BD6.3-L6.6-W6.6-LS7.2-FD_3
  rect 3.5x1.2 smd: 1(-2.67,0) 2(2.67,0)
CONN-TH_XT30U-M
  round 3.8 hole 2.54: 1(-2.5,0) 2(2.5,0)
CONN-TH_XT30UW-F.G.Y
  round 3.8 hole 2.8: 1(-2.5,0) 2(2.5,0)
CRYSTAL-SMD_4P-L3.2-W2.5-BL_SIT8008BI
  rect 1.4x1.2 smd: 1(-1.1,-0.85) 2(1.1,-0.85) 3(1.1,0.85) 4(-1.1,0.85)
F1206
  rect 1.19x1.728 smd: 1(-1.445,0) 2(1.445,0)
HDR-TH_3P-P2.54-V-M
  rect 1.7x1.7 hole 1.1: 1(-2.54,0)
  round 1.7 hole 1.1: 2(0,0) 3(2.54,0)
HDR-TH_4P-P2.54-V-M
  rect 1.7x1.7 hole 1.1: 1(-3.81,0)
  round 1.7 hole 1.1: 2(-1.27,0) 3(1.27,0) 4(3.81,0)
HDR-TH_6P-P2.54-V-M-1
  rect 1.8x1.8 hole 1.2: 1(-6.35,0)
  round 1.8 hole 1.2: 2(-3.81,0) 3(-1.27,0) 4(1.27,0) 5(3.81,0) 6(6.35,0)
HDR-TH_8P-P2.54-V-M-4
  rect 1.5x1.5 hole 1: 1(-8.89,0)
  round 1.5 hole 1: 2(-6.35,0) 3(-3.81,0) 4(-1.27,0) 5(1.27,0) 6(3.81,0) 7(6.35,0) 8(8.89,0)
IND-SMD_L7.0-W6.6
  rect 2.4x3.2 smd: 1(-3,0) 2(3,0)
LED_0603
  rect 0.8x0.8 smd: 1(-0.851,-0.01) 2(0.75,-0.005)
LQFP-48_L7.0-W7.0-P0.50-LS9.0-BL
  oval 0.27x1.5 smd: 1(-2.75,-4.25) 2(-2.25,-4.25) 3(-1.75,-4.25) 4(-1.25,-4.25) 5(-0.75,-4.25) 6(-0.25,-4.25) 7(0.25,-4.25) 8(0.75,-4.25) 9(1.25,-4.25) 10(1.75,-4.25) 11(2.25,-4.25) 12(2.75,-4.25) 25(2.75,4.25) 26(2.25,4.25) 27(1.75,4.25) 28(1.25,4.25) 29(0.75,4.25) 30(0.25,4.25) 31(-0.25,4.25) 32(-0.75,4.25) 33(-1.25,4.25) 34(-1.75,4.25) 35(-2.25,4.25) 36(-2.75,4.25)
  oval 1.5x0.27 smd: 13(4.25,-2.75) 14(4.25,-2.25) 15(4.25,-1.75) 16(4.25,-1.25) 17(4.25,-0.75) 18(4.25,-0.25) 19(4.25,0.25) 20(4.25,0.75) 21(4.25,1.25) 22(4.25,1.75) 23(4.25,2.25) 24(4.25,2.75) 37(-4.25,2.75) 38(-4.25,2.25) 39(-4.25,1.75) 40(-4.25,1.25) 41(-4.25,0.75) 42(-4.25,0.25) 43(-4.25,-0.25) 44(-4.25,-0.75) 45(-4.25,-1.25) 46(-4.25,-1.75) 47(-4.25,-2.25) 48(-4.25,-2.75)
M2螺丝
  round 2 hole 2: 1(0,0)
R0603
  rect 0.806x0.864 smd: 1(-0.753,0) 2(0.753,0)
R1206
  rect 1.208x1.701 smd: 1(-1.479,0) 2(1.479,0)
SOT-23-3_L2.9-W1.3-P1.90-LS2.4-BR
  rect 1.25x0.7 smd: 1(1,-0.95) 2(1,0.95) 3(-1,0)
SOT-23-6_L2.9-W1.6-P0.95-LS2.8-BR
  rect 1.1x0.6 smd: 1(1.35,-0.95) 2(1.35,0) 3(1.35,0.95) 4(-1.35,0.95) 5(-1.35,0) 6(-1.35,-0.95)
SOT-223-3_L6.5-W3.4-P2.30-LS7.0-BR
  rect 2.5x1.1 smd: 1(2.97,-2.3) 2(2.97,0) 3(2.97,2.3)
  rect 2.34x3.6 smd: 4(-2.97,0)
SW-SMD_4P-L6.0-W6.0-P4.50-LS8.8
  rect 1.7x1.1 smd: 1(-4,2.25) 2(-4,-2.25) 3(4,2.25) 4(4,-2.25)

## Nets
As in the schematic.

Pads without a net: SCREW1 1; SCREW2 1; SCREW3 1; SCREW4 1

## Via types
v1: diameter 0.61, hole 0.305, Top Layer to Bottom Layer, 69 vias

## Routing (per net, layer and track width the routed paths; a pad name or vN(x,y) marks a point on that pad's centre or on a via; arc(x,y) is an arc through that point)
3.3V: length 40.4
  Top Layer w0.203: U18.1 22.25,59.7 22.1,59.55 C31.2 ; U18.24 32.25,67.75 C28.2
  Top Layer w0.254: 22.19,68.4 22.19,68.81 22.22,68.85 22.22,69.22 U18.36 ; 22.19,68.4 22.15,68.44 20.32,68.44 20.13,68.63 C30.2 ; 22.19,68.4 22.19,68.08 22.22,68.05 v1(22.22,66.79) ; C29.2 19.69,61.71 20.22,62.25 U18.48 22.25,62.25 ; 22.25,62.25 v1(23.88,62.25) ; 22.25,62.25 U18.1 ; v1(27.18,67.55) 28.12,67.55 28.38,67.81 28.81,67.81 28.87,67.75 U18.24
  Top Layer w0.508: R17.2 9.24,56.12 v1(9.22,56.14) ; v1(34.4,67.81) v1(33.53,67.81) 33.46,67.74 C28.2
  Bottom Layer w0.254: v1(27.18,67.55) 24.26,67.55 23.88,67.17 23.88,65.14 ; v1(23.88,62.25) 23.88,65.14 ; 23.88,65.14 v1(22.22,66.79)
5V:
  vias: v1(37.21,75.96) v1(37.21,75.17) v1(37.21,70.12) v1(38.1,75.96) v1(38.1,75.17) v1(38.1,70.12) v1(40.64,41.65) v1(40.65,40.74) v1(40.64,39.87) v1(41.64,41.65) v1(41.63,40.74) v1(41.66,39.87)
12V: length 8.6
  Top Layer w0.254: R27.2 29.73,12.83 29.59,12.69
A3.3V: length 3.8
  Top Layer w0.203: C37.2 26.25,57.04 U18.9
AGND: length 4.7
  Top Layer w0.203: U18.8 25.75,60.34 25.71,60.3 25.71,59.7 25.75,59.66 25.75,58.12 25.65,58.03 24.89,58.03 24.76,57.9 24.76,57.05 24.81,57
GND: length 80.8
  Top Layer w0.178: U18.35 22.75,69.68 22.73,69.7 22.73,70.1 22.48,70.35 18.92,70.35 18.8,70.22 18.8,69.4 C30.1 ; C29.1 15.37,61.77 15.37,62.35 15.62,62.6 19.76,62.6 19.94,62.77 20.43,62.77 20.45,62.75 U18.47
  Top Layer w0.254: U18.23 29.16,67.16 28.46,67.16 28.22,66.92 26.42,66.92 25.91,67.43 25.91,67.94 26.16,68.19 27.43,68.19 27.46,68.22 27.92,68.22 28.16,68.46 28.16,68.92 28.39,69.14 C28.1 ; SW2.3 SW2.1 ; 24.41,58.54 v1(24.26,58.54) 24.05,58.33 23.8,58.33 23.5,58.03 v1(23.37,58.03) v1(22.38,58.03) 21.72,58.03 v1(21.46,57.78) 20.43,56.74 v1(20.43,56.1) v1(20.43,55.25) 20.82,54.85 v1(21.17,54.85) v1(22.35,54.85) 23.11,54.09 v1(23.11,54.05) v1(23.11,53.13) v1(23.11,52.21) 23.11,51.33 v1(22.45,50.66) v1(21.36,50.66) v1(20.28,50.66) v1(19.2,50.66) v1(18.11,50.66) v1(17.03,50.66) v1(15.94,50.66) 14.59,50.66 v1(14.1,51.15) v1(14.1,52.17) v1(14.1,53.2) 14.1,54.05 v1(14.9,54.85) v1(15.75,54.85) 17.36,54.85 v1(17.78,55.28) v1(17.78,56.12) 17.78,56.5 18.16,56.89 v1(18.29,56.89) 18.29,57.14 v1(18.8,57.65) 19.43,58.28 v1(19.56,58.28) 20.19,58.92 v1(20.32,58.92) ; U18.47 20.77,62.73 21.1,62.73 21.19,62.81 21.91,62.81 22,62.73 22.61,62.73 22.84,62.96 22.84,69.16 U18.35
  Top Layer w0.508: v1(14.1,53.2) 14.32,53.42 C22.2 17.09,53.42 X1.2 ; X1.4 21.55,52.05 C21.2 23.05,52.15 v1(23.11,52.21)
  vias: v1(14.1,54.22) v1(14.86,50.66) v1(16.89,54.98) v1(20.83,57.01) v1(23.11,51.3)
BOOT0: length 17
  Top Layer w0.203: U18.44 20.32,64.25 20.3,64.27 19.79,64.27 19.76,64.25 6.22,64.25 5.97,64 5.97,63.62 5.84,63.49 R7.2
NRST: length 43
  Top Layer w0.203: SW2.4 12.76,50.85 12.95,50.66 12.95,50.41 v1(13.46,49.9) ; U18.7 25.25,59.53 v1(25.02,59.3)
  Top Layer w0.254: C26.2 6.27,54.45 6.29,54.47 6.29,53.31 7.2,52.39 SW2.4 SW2.2
  Bottom Layer w0.203: v1(25.02,59.3) 25.02,50.41 24.51,49.9 v1(13.46,49.9)
PA0: length 52.6
  Top Layer w0.203: v1(29.21,59.81) 28.59,60.42 28.59,61.5 28.04,62.06 27.22,62.06 26.71,61.55 26.71,61.2 26.75,61.16 U18.10
  Bottom Layer w0.203: 驱动1.4 42.42,28.56 42.16,28.82 42.16,35.55 41.15,36.57 29.59,36.57 29.21,36.95 v1(29.21,59.81)
PA1: length 49.6
  Top Layer w0.203: U18.11 27.36,60.86 27.36,61.53 27.59,61.75 27.91,61.75 28.29,61.38 28.29,59.08 28.45,58.92 v1(29.97,58.92)
  Bottom Layer w0.203: v1(29.97,58.92) 29.97,37.33 30.23,37.07 41.66,37.07 42.54,36.19 42.54,31.23 42.67,31.11 驱动1.5
PA2: length 54.1
  Top Layer w0.203: U18.12 27.75,59.74 v1(26.92,58.92)
  Bottom Layer w0.203: v1(26.92,58.92) 26.92,36.06 27.18,35.8 41.28,35.8 41.66,35.42 41.66,35.36 41.8,35.21 41.8,33.22 41.66,33.08 41.66,26.53 42.16,26.03 驱动1.3
PA3: length 39.9
  Top Layer w0.203: U18.13 29.66,62.25 29.7,62.21 30.3,62.21 30.34,62.25 30.58,62.25 31.5,61.33 v1(34.67,61.33)
  Bottom Layer w0.203: 驱动1.8 35.31,38.72 34.67,39.36 v1(34.67,61.33)
PA4: length 45
  Top Layer w0.203: U18.14 31.73,62.75 v1(32,62.47)
  Bottom Layer w0.203: 驱动1.6 43.43,33.64 43.05,34.03 43.05,36.44 41.91,37.58 32.51,37.58 32,38.09 v1(32,62.47)
PA5: length 42.6
  Top Layer w0.203: v1(33.53,62.6) 32.88,63.25 30.34,63.25 30.3,63.29 29.7,63.29 29.66,63.25 U18.15
  Bottom Layer w0.203: 驱动1.7 46.35,36.06 44.07,36.06 41.91,38.22 33.91,38.22 33.53,38.6 v1(33.53,62.6)
PA6: length 19.7
  Top Layer w0.254: U18.16 41.78,63.75 42.04,63.5 42.04,61.58 42.66,60.96 45.47,60.96 45.72,61.22 电机1.2
PA7: length 15.7
  Top Layer w0.254: 电机1.3 43.18,63.62 42.55,64.25 U18.17
PA8: length 8.4
  Top Layer w0.254: 舵机1.1 25.4,73.27 25.75,72.92 U18.29
PA9: length 10.7
  Top Layer w0.254: 舵机2.1 18.02,72.14 18.41,71.75 24.76,71.75 25.25,71.26 25.25,70.48 25.19,70.42 25.19,69.69 25.25,69.63 U18.30
PA10: length 13.6
  Top Layer w0.254: U18.31 24.75,71 24.36,71.39 14.99,71.39 14.73,71.64 14.73,73.2 舵机3.1
PA11: length 16.4
  Top Layer w0.254: 舵机4.1 11.43,73.15 11.43,71.36 11.76,71.03 23.83,71.03 24.25,70.61 U18.32
PA12: length 59.2
  Top Layer w0.203: U18.33 v1(23.75,67.94)
  Bottom Layer w0.203: 3.94,29.07 11.99,29.07 12.19,29.28 12.19,54.85 13.59,56.25 15.88,56.25 16.13,56.5 16.13,67.94 16.51,68.32 23.11,68.32 23.5,67.94 v1(23.75,67.94)
PA13: length 24.8
  Top Layer w0.254: 调试接口.1 9.53,78.35 9.91,77.97 9.91,71.62 10.85,70.68 22.78,70.68 23.25,70.21 U18.34
PA14: length 17.4
  Top Layer w0.254: 调试接口.3 8.89,73.27 9.4,72.76 9.4,71.36 10.79,69.97 13.46,69.97 15.68,67.75 U18.37
PA15: length 65.8
  Top Layer w0.203: U18.38 20.34,67.25 20.3,67.21 19.6,67.21 19.56,67.25 15.67,67.25 14.1,68.82 12.95,68.82 12.7,68.57 12.7,66.28 13.08,65.9 16.68,65.9 v1(16.7,65.92)
  Bottom Layer w0.203: 驱动2.6 12.06,26.53 12.5,26.97 12.5,53.76 14.35,55.62 16.23,55.62 16.7,56.09 v1(16.7,65.92)
PB0: length 17.7
  Top Layer w0.254: 电机2.2 45.85,64.89 45.71,64.75 43.79,64.75 43.73,64.69 29.69,64.69 29.63,64.75 U18.18
PB1: length 16.5
  Top Layer w0.254: 电机2.3 43.37,65.92 43.37,67.24 43.18,67.43 38.35,67.43 36.18,65.25 U18.19
PB2: length 76.4
  Top Layer w0.203: v1(35.81,65.9) 35.66,65.75 30.44,65.75 30.4,65.79 29.7,65.79 29.66,65.75 U18.20
  Bottom Layer w0.203: v1(35.81,65.9) 31.37,65.9 30.61,66.67 30.61,68.44 30.4,68.64 15.57,68.64 15.37,68.44 15.37,57.52 14.86,57.01 12.57,57.01 11.81,56.25 11.81,32.38 11.05,31.61 驱动2.4
PB3: length 45
  Top Layer w0.203: U18.39 20.64,66.86 15.04,66.86 13.69,68.21 v1(13.26,68.21)
  Bottom Layer w0.203: v1(13.26,68.21) 13.26,67.38 13.09,67.21 13.09,59.05 12.45,58.41 11.68,58.41 10.92,57.65 10.92,40.12 10.03,39.23 驱动2.1
PB4: length 48.8
  Top Layer w0.203: v1(13.72,67.05) 14.43,67.05 14.92,66.56 19.78,66.56 19.97,66.36 20.64,66.36 U18.40
  Bottom Layer w0.203: v1(13.72,67.05) 13.72,58.54 12.95,57.78 11.81,57.78 11.3,57.27 11.3,35.04 10.41,34.15 驱动2.3
PB5: length 44.1
  Top Layer w0.203: 驱动2.2 3.94,36.82 8.51,41.39 8.51,48.63 8.78,48.9 14.24,48.9 14.35,49.01 14.35,49.9 13.47,50.79 13.47,55.11 15.75,57.39 v1(17.4,57.39) ; U18.41 v1(21.97,65.75)
  Bottom Layer w0.203: v1(21.97,65.75) 21.97,61.84 20.32,60.19 17.91,60.19 17.4,59.68 v1(17.4,57.39)
PB6: length 20.5
  Top Layer w0.203: 电机4.2 4.14,66.59 4.14,68.77 4.32,68.95 9.6,68.95 13.22,65.34 20.66,65.34 U18.42
PB7: length 16.6
  Top Layer w0.203: U18.43 20.69,64.81 20.38,64.81 20.3,64.73 19.79,64.73 19.71,64.81 13.03,64.81 9.91,67.94 7.11,67.94 6.73,67.55 电机4.3
PB8: length 17.8
  Top Layer w0.203: 4.44,60.06 8.05,63.66 20.66,63.66 U18.45
PB9: length 15.8
  Top Layer w0.254: 电机3.3 6.98,61.2 8.94,63.16 20.29,63.16 20.37,63.25 U18.46
PB10: length 18.4
  Top Layer w0.254: 串口.2 45.72,68.44 45.06,67.78 36.55,67.78 35.02,66.25 30.48,66.25 30.41,66.19 29.69,66.19 29.63,66.25 U18.21
PB11: length 15.5
  Top Layer w0.254: 串口.1 43.18,68.7 42.65,68.16 36.42,68.16 35.01,66.75 U18.22
PB12: length 16.4
  Top Layer w0.254: U18.25 27.75,70.41 27.94,70.6 35.31,70.6 35.56,70.86 手柄.4
PB13: length 14.2
  Top Layer w0.254: U18.26 27.25,69.63 27.19,69.69 27.19,70.42 27.73,70.96 28.96,70.96 28.98,70.98 32.77,70.98 33.02,71.24 手柄.3
PB14: length 11.9
  Top Layer w0.254: 手柄.2 30.48,71.62 30.23,71.36 28.86,71.36 28.84,71.34 27.61,71.34 26.83,70.56 26.83,69.33 U18.27
PB15: length 9.5
  Top Layer w0.254: 手柄.1 27.94,72.17 26.34,70.57 26.34,69.34 U18.28
PD0-OSC_IN: length 15.3
  Top Layer w0.203: 15.3,52.02 17.4,52.02 X1.3 18.28,52.05 18.41,52.19 18.41,56.12 21.21,58.92 23.08,58.92 24.25,60.09 U18.5
PD1-OSC_OUT: length 12.5
  Top Layer w0.203: C21.1 19.83,53.55 X1.1 19.69,53.81 19.69,56.89 21.41,58.61 23.51,58.61 24.79,59.89 24.79,60.3 24.75,60.34 U18.6
$1N6828: length 3.6
  Top Layer w0.203: U26.2 29.72,14.47 29.91,14.66 C39.2
$1N7531: length 1.6
  Top Layer w0.508: LED3.1 9.4,32.34 R26.2
$1N7618: length 3.1
  Top Layer w0.203: C39.1 32,17.13 32.26,16.88 32.26,15.61 32.06,15.42 U26.6
$1N7672: length 6.6
  Top Layer w0.254: U26.5 37.96,14.47 R27.1
$1N7875: length 52.9
  Top Layer w0.254: v1(38.99,13.58) 31.64,13.58 U26.4 ; R1.1 11.18,20.68 R2.2 11.31,24.89 11.56,25.14 38.99,25.14 v1(39.37,24.75)
  Bottom Layer w0.254: v1(38.99,13.58) 39.37,13.96 v1(39.37,24.75)
$2N2524: length 6.2
  Top Layer w0.508: R23.1 30.62,49.27 R22.2 28.45,49.32 28.45,52.06 28.13,52.38 U19.1
$4N488: length 2
  Top Layer w0.508: R12.2 45.17,55.79 LED1.1

## Copper pours and planes (outline as drawn; the poured copper is in the pictures)
3.3V on Top Layer: 35.94,54.55 44.83,54.55 44.83,43.3 35.94,43.3
3.3V on Top Layer: 41.53,59.68 43.21,59.68 43.21,57.46 41.53,57.46
3.3V on Top Layer: 39.62,63.11 43.21,63.11 43.21,57.46 39.62,57.46
3.3V on Top Layer: 42.16,59.68 43.18,59.68 43.18,54.35 42.16,54.35
3.3V on Bottom Layer: 8.25,67.55 10.51,67.55 10.51,52.95 8.25,52.95
3.3V on Bottom Layer: 8.25,71.75 36.19,71.75 36.19,69.84 8.25,69.84
3.3V on Bottom Layer: 39.62,74.16 41.78,74.16 41.78,61.08 39.62,61.08
3.3V on Bottom Layer: 31.62,74.16 40,74.16 40,67.17 31.62,67.17
3.3V on Bottom Layer: 5.46,71.75 10.41,71.75 10.41,65.65 5.46,65.65
5V on Top Layer: 36.38,76.84 38.99,76.84 38.99,69.71 36.38,69.71
5V on Top Layer: 39.75,45.96 44.07,45.96 44.07,29.2 39.75,29.2
5V on Top Layer: 6.37,31.23 44.07,31.23 44.07,23.12 6.37,23.12
5V on Bottom Layer: 10.26,76.88 39.22,76.88 39.22,74.54 10.26,74.54
5V on Bottom Layer: 36.38,42.08 44.07,42.08 44.07,39.4 36.38,39.4
5V on Bottom Layer: 36.96,79.24 39.22,79.24 39.22,76.27 36.96,76.27
5V on Bottom Layer: 36.38,70.45 39.12,70.45 39.12,39.53 36.38,39.53
12V on Top Layer: 16.76,10.66 30.35,10.66 30.35,6.34 16.76,6.34
12V on Top Layer: 28.18,13.89 30.23,13.89 30.23,10.53 28.18,10.53
12V on Bottom Layer: 41.02,22.22 47.88,22.22 47.88,6.09 41.02,6.09
12V on Bottom Layer: 2.67,10.77 47.88,10.77 47.88,6.09 2.67,6.09
12V on Bottom Layer: 2.67,22.68 10.41,22.68 10.41,9.26 2.67,9.26
A3.3V on Top Layer: 38.48,59.81 40.13,59.81 40.13,57.27 38.48,57.27
A3.3V on Top Layer: 25.65,58.28 40.13,58.28 40.13,48 25.65,48
AGND on Top Layer: 23.74,57.9 27.69,57.9 27.69,46.16 23.74,46.16
GND on Top Layer: -5.72,83.94 60.71,83.94 60.71,-4.96 -5.72,-4.96
GND on Bottom Layer: -7.62,85.59 58.42,85.59 58.42,-6.36 -7.62,-6.36
FB111 on Top Layer: 6.35,21.71 14.28,21.71 14.28,14.72 6.35,14.72
FB111 on Top Layer: 11.05,16.63 20.57,16.63 20.57,12.06 11.05,12.06
$1N6828 on Top Layer: 23.88,16.5 29.59,16.5 29.59,12.94 23.88,12.94

Small or netless copper shapes (teardrops, artwork), in the pictures only: 174 on Top Layer, 31 on Bottom Layer
